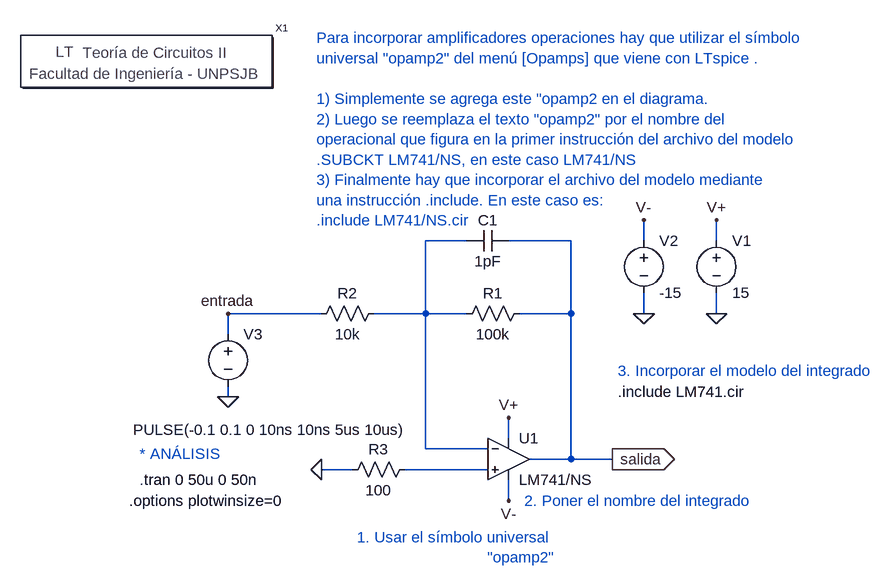
[diagram p0: schematic Como se incorporan los amplificadores operacionales.asc]
Como se incorporan los amplificadores operacionales.asc, the LTspice schematic file:
Version 4
SHEET 1 1200 1172
WIRE 64 -128 0 -128
WIRE 224 -128 128 -128
WIRE 336 -128 336 -160
WIRE 448 -128 448 -160
WIRE -160 -16 -304 -16
WIRE 0 -16 0 -128
WIRE 0 -16 -80 -16
WIRE 64 -16 0 -16
WIRE 224 -16 224 -128
WIRE 224 -16 144 -16
WIRE 336 -16 336 -48
WIRE 448 -16 448 -48
WIRE -304 16 -304 -16
WIRE -304 112 -304 96
WIRE 128 176 128 144
WIRE 0 192 0 -16
WIRE 96 192 0 192
WIRE 224 208 224 -16
WIRE 224 208 160 208
WIRE 288 208 224 208
WIRE -112 224 -160 224
WIRE 96 224 -32 224
WIRE 128 272 128 240
FLAG 448 -16 0
FLAG -160 224 0
FLAG -304 112 0
FLAG 288 208 salida
IOPIN 288 208 Out
FLAG 336 -16 0
FLAG -304 -16 entrada
FLAG 128 144 V+
FLAG 128 272 V-
FLAG 336 -160 V-
FLAG 448 -160 V+
SYMBOL voltage 448 -144 R0
WINDOW 123 0 0 Left 2
WINDOW 39 0 0 Left 2
SYMATTR InstName V1
SYMATTR Value 15
SYMBOL voltage 336 -144 R0
WINDOW 123 0 0 Left 2
WINDOW 39 0 0 Left 2
SYMATTR InstName V2
SYMATTR Value -15
SYMBOL res -64 -32 R90
WINDOW 0 0 56 VBottom 2
WINDOW 3 32 56 VTop 2
SYMATTR InstName R2
SYMATTR Value 10k
SYMBOL voltage -304 0 R0
WINDOW 3 -146 163 Left 2
WINDOW 123 0 0 Left 2
WINDOW 39 0 0 Left 2
SYMATTR Value PULSE(-0.1 0.1 0 10ns 10ns 5us 10us)
SYMATTR InstName V3
SYMBOL cap 128 -144 R90
WINDOW 0 0 32 VBottom 2
WINDOW 3 32 32 VTop 2
SYMATTR InstName C1
SYMATTR Value 1pF
SYMBOL res 160 -32 R90
WINDOW 0 0 56 VBottom 2
WINDOW 3 32 56 VTop 2
SYMATTR InstName R1
SYMATTR Value 100k
SYMBOL Opamps\\opamp2 128 144 R0
SYMATTR InstName U1
SYMATTR Value LM741/NS
SYMBOL res -128 240 R270
WINDOW 0 32 56 VTop 2
WINDOW 3 0 56 VBottom 2
SYMATTR InstName R3
SYMATTR Value 100
SYMBOL Circuitos2\\Letreros\\Teoría\ de\ Circuitos\ II -432 -400 R0
SYMATTR InstName X1
TEXT -440 240 Left 2 !.tran 0 50u 0 50n
TEXT 200 328 Right 2 ;1. Usar el símbolo universal \n"opamp2"
TEXT 296 104 Left 2 !.include LM741.cir
TEXT -456 272 Left 2 !.options plotwinsize=0
TEXT 296 72 Left 2 ;3. Incorporar el modelo del integrado
TEXT -440 200 Left 2 ;* ANÁLISIS
TEXT -168 -440 Left 2 ;Para incorporar amplificadores operaciones hay que utilizar el símbolo\nuniversal "opamp2" del menú [Opamps] que viene con LTspice .\n \n1) Simplemente se agrega este "opamp2 en el diagrama.\n2) Luego se reemplaza el texto "opamp2" por el nombre del\noperacional que figura en la primer instrucción del archivo del modelo\n.SUBCKT LM741/NS, en este caso LM741/NS\n3) Finalmente hay que incorporar el archivo del modelo mediante\nuna instrucción .include. En este caso es:\n.include LM741/NS.cir
TEXT 152 272 Left 2 ;2. Poner el nombre del integrado

The netlist it stands for:
* Como se incorporan los amplificadores operacionales.asc
V1 V+ 0 15
V2 V- 0 -15
R2 N001 entrada 10k
V3 entrada 0 PULSE(-0.1 0.1 0 10ns 10ns 5us 10us)
C1 salida N001 1pF
R1 salida N001 100k
XU1 N002 N001 V+ V- salida LM741/NS  ; pins In+ In- V+ V- OUT
R3 0 N002 100
XX1 Teoría de Circuitos II
.tran 0 50u 0 50n
* 1. Usar el símbolo universal
* "opamp2"
.include LM741.cir
.options plotwinsize=0
* 3. Incorporar el modelo del integrado
* * ANÁLISIS
* Para incorporar amplificadores operaciones hay que utilizar el símbolo
* universal "opamp2" del menú [Opamps] que viene con LTspice .
* 1) Simplemente se agrega este "opamp2 en el diagrama.
* 2) Luego se reemplaza el texto "opamp2" por el nombre del
* operacional que figura en la primer instrucción del archivo del modelo
* .SUBCKT LM741/NS, en este caso LM741/NS
* 3) Finalmente hay que incorporar el archivo del modelo mediante
* una instrucción .include. En este caso es:
* .include LM741/NS.cir
* 2. Poner el nombre del integrado
.backanno
.end